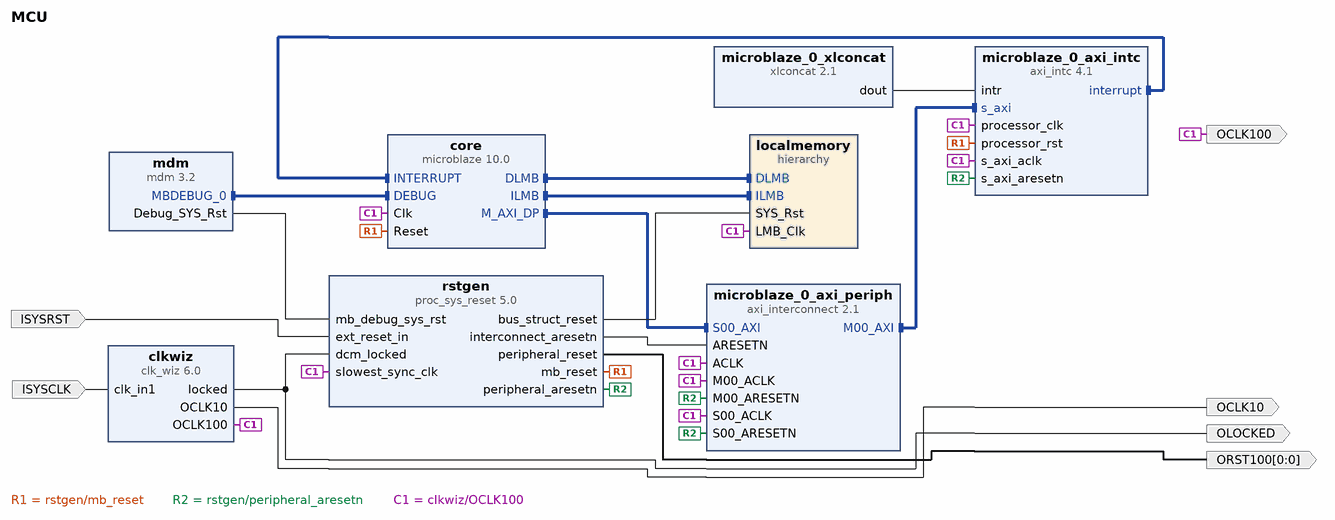
[diagram p0: block diagram of the top level]
# Vivado block design MCU, xc7a35ticsg324-1L, Vivado 2018.1
create_bd_design MCU

create_bd_port -dir I -type clk ISYSCLK
set_property -dict {CONFIG.FREQ_HZ 12000000} [get_bd_ports ISYSCLK]
create_bd_port -dir O -type clk OCLK100
create_bd_port -dir O -type clk OCLK10
set_property -dict {CONFIG.FREQ_HZ 10000000} [get_bd_ports OCLK10]
create_bd_port -dir I -type rst ISYSRST
set_property -dict {CONFIG.POLARITY ACTIVE_HIGH} [get_bd_ports ISYSRST]
create_bd_port -dir O OLOCKED
create_bd_port -dir O -from 0 -to 0 -type rst ORST100

create_bd_cell -type ip -vlnv xilinx.com:ip:microblaze:10.0 core
set_property -dict {CONFIG.C_D_AXI 1 CONFIG.C_D_LMB 1 CONFIG.C_I_LMB 1 CONFIG.C_DEBUG_ENABLED 1} [get_bd_cells core]
create_bd_cell -type hier localmemory
create_bd_cell -type ip -vlnv xilinx.com:ip:axi_interconnect:2.1 microblaze_0_axi_periph
set_property -dict {CONFIG.NUM_MI 1} [get_bd_cells microblaze_0_axi_periph]
create_bd_cell -type ip -vlnv xilinx.com:ip:axi_intc:4.1 microblaze_0_axi_intc
set_property -dict {CONFIG.C_HAS_FAST 1} [get_bd_cells microblaze_0_axi_intc]
create_bd_cell -type ip -vlnv xilinx.com:ip:xlconcat:2.1 microblaze_0_xlconcat
create_bd_cell -type ip -vlnv xilinx.com:ip:mdm:3.2 mdm
create_bd_cell -type ip -vlnv xilinx.com:ip:clk_wiz:6.0 clkwiz
set_property -dict [list \
  CONFIG.CLKOUT2_USED true \
  CONFIG.NUM_OUT_CLKS 2 \
  CONFIG.CLK_OUT1_PORT OCLK100 \
  CONFIG.CLK_OUT2_PORT OCLK10 \
  CONFIG.CLKOUT2_REQUESTED_OUT_FREQ 10.000 \
  CONFIG.PRIM_SOURCE Single_ended_clock_capable_pin \
  CONFIG.USE_RESET false \
  CONFIG.MMCM_DIVCLK_DIVIDE 1 \
  CONFIG.MMCM_CLKOUT1_DIVIDE 75 \
  CONFIG.CLKOUT2_JITTER 705.336 \
  CONFIG.CLKOUT2_PHASE_ERROR 668.310 \
] [get_bd_cells clkwiz]
create_bd_cell -type ip -vlnv xilinx.com:ip:proc_sys_reset:5.0 rstgen

# ---- hierarchy /localmemory ----
current_bd_instance /localmemory
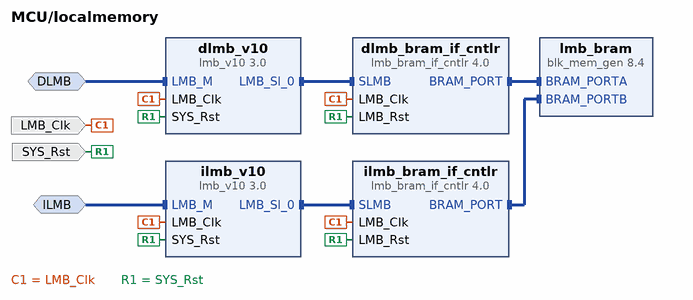
[diagram p1: block diagram inside /localmemory]
create_bd_intf_pin -mode MirroredMaster -vlnv xilinx.com:interface:lmb_rtl:1.0 DLMB
create_bd_intf_pin -mode MirroredMaster -vlnv xilinx.com:interface:lmb_rtl:1.0 ILMB
create_bd_pin -dir I -type clk LMB_Clk
create_bd_pin -dir I -type rst SYS_Rst

create_bd_cell -type ip -vlnv xilinx.com:ip:lmb_v10:3.0 dlmb_v10
create_bd_cell -type ip -vlnv xilinx.com:ip:lmb_v10:3.0 ilmb_v10
create_bd_cell -type ip -vlnv xilinx.com:ip:lmb_bram_if_cntlr:4.0 dlmb_bram_if_cntlr
set_property -dict {CONFIG.C_ECC 0} [get_bd_cells dlmb_bram_if_cntlr]
create_bd_cell -type ip -vlnv xilinx.com:ip:lmb_bram_if_cntlr:4.0 ilmb_bram_if_cntlr
set_property -dict {CONFIG.C_ECC 0} [get_bd_cells ilmb_bram_if_cntlr]
create_bd_cell -type ip -vlnv xilinx.com:ip:blk_mem_gen:8.4 lmb_bram
set_property -dict {CONFIG.Memory_Type True_Dual_Port_RAM CONFIG.use_bram_block BRAM_Controller} [get_bd_cells lmb_bram]

# ---- connections ----

current_bd_instance /localmemory
connect_bd_intf_net -intf_net microblaze_0_dlmb_bus [get_bd_intf_pins dlmb_v10/LMB_Sl_0] [get_bd_intf_pins dlmb_bram_if_cntlr/SLMB]
connect_bd_intf_net -intf_net microblaze_0_ilmb_bus [get_bd_intf_pins ilmb_v10/LMB_Sl_0] [get_bd_intf_pins ilmb_bram_if_cntlr/SLMB]
connect_bd_intf_net -intf_net microblaze_0_dlmb_cntlr [get_bd_intf_pins dlmb_bram_if_cntlr/BRAM_PORT] [get_bd_intf_pins lmb_bram/BRAM_PORTA]
connect_bd_intf_net -intf_net microblaze_0_ilmb_cntlr [get_bd_intf_pins ilmb_bram_if_cntlr/BRAM_PORT] [get_bd_intf_pins lmb_bram/BRAM_PORTB]
connect_bd_intf_net -intf_net microblaze_0_dlmb [get_bd_intf_pins DLMB] [get_bd_intf_pins dlmb_v10/LMB_M]
connect_bd_intf_net -intf_net microblaze_0_ilmb [get_bd_intf_pins ILMB] [get_bd_intf_pins ilmb_v10/LMB_M]
connect_bd_net -net microblaze_0_Clk [get_bd_pins LMB_Clk] \
  [get_bd_pins dlmb_v10/LMB_Clk] [get_bd_pins dlmb_bram_if_cntlr/LMB_Clk] [get_bd_pins ilmb_v10/LMB_Clk] \
  [get_bd_pins ilmb_bram_if_cntlr/LMB_Clk]
connect_bd_net [get_bd_pins SYS_Rst] \
  [get_bd_pins dlmb_v10/SYS_Rst] [get_bd_pins dlmb_bram_if_cntlr/LMB_Rst] [get_bd_pins ilmb_v10/SYS_Rst] \
  [get_bd_pins ilmb_bram_if_cntlr/LMB_Rst]

current_bd_instance /
connect_bd_intf_net -intf_net microblaze_0_dlmb_1 [get_bd_intf_pins core/DLMB] [get_bd_intf_pins localmemory/DLMB]
connect_bd_intf_net -intf_net microblaze_0_ilmb_1 [get_bd_intf_pins core/ILMB] [get_bd_intf_pins localmemory/ILMB]
connect_bd_intf_net -intf_net microblaze_0_axi_dp [get_bd_intf_pins microblaze_0_axi_periph/S00_AXI] [get_bd_intf_pins core/M_AXI_DP]
connect_bd_intf_net -intf_net microblaze_0_interrupt [get_bd_intf_pins microblaze_0_axi_intc/interrupt] [get_bd_intf_pins core/INTERRUPT]
connect_bd_intf_net -intf_net microblaze_0_intc_axi [get_bd_intf_pins microblaze_0_axi_periph/M00_AXI] [get_bd_intf_pins microblaze_0_axi_intc/s_axi]
connect_bd_intf_net -intf_net microblaze_0_debug [get_bd_intf_pins mdm/MBDEBUG_0] [get_bd_intf_pins core/DEBUG]
connect_bd_net -net microblaze_0_intr [get_bd_pins microblaze_0_xlconcat/dout] [get_bd_pins microblaze_0_axi_intc/intr]
connect_bd_net -net clk_wiz_1_locked [get_bd_pins clkwiz/locked] [get_bd_pins rstgen/dcm_locked] [get_bd_ports OLOCKED]
connect_bd_net -net rst_clk_wiz_1_100M_mb_reset [get_bd_pins rstgen/mb_reset] \
  [get_bd_pins core/Reset] [get_bd_pins microblaze_0_axi_intc/processor_rst]
connect_bd_net -net rst_clk_wiz_1_100M_bus_struct_reset [get_bd_pins rstgen/bus_struct_reset] [get_bd_pins localmemory/SYS_Rst]
connect_bd_net -net rst_clk_wiz_1_100M_interconnect_aresetn [get_bd_pins rstgen/interconnect_aresetn] [get_bd_pins microblaze_0_axi_periph/ARESETN]
connect_bd_net -net rst_clk_wiz_1_100M_peripheral_aresetn [get_bd_pins rstgen/peripheral_aresetn] \
  [get_bd_pins microblaze_0_axi_periph/S00_ARESETN] [get_bd_pins microblaze_0_axi_periph/M00_ARESETN] \
  [get_bd_pins microblaze_0_axi_intc/s_axi_aresetn]
connect_bd_net -net mdm_1_debug_sys_rst [get_bd_pins mdm/Debug_SYS_Rst] [get_bd_pins rstgen/mb_debug_sys_rst]
connect_bd_net -net clk_in1_0_1 [get_bd_ports ISYSCLK] [get_bd_pins clkwiz/clk_in1]
connect_bd_net [get_bd_pins clkwiz/OCLK100] \
  [get_bd_ports OCLK100] [get_bd_pins core/Clk] [get_bd_pins microblaze_0_axi_periph/ACLK] \
  [get_bd_pins microblaze_0_axi_periph/S00_ACLK] [get_bd_pins microblaze_0_axi_periph/M00_ACLK] \
  [get_bd_pins microblaze_0_axi_intc/s_axi_aclk] [get_bd_pins microblaze_0_axi_intc/processor_clk] \
  [get_bd_pins localmemory/LMB_Clk] [get_bd_pins rstgen/slowest_sync_clk]
connect_bd_net [get_bd_pins clkwiz/OCLK10] [get_bd_ports OCLK10]
connect_bd_net -net ext_reset_in_0_1 [get_bd_ports ISYSRST] [get_bd_pins rstgen/ext_reset_in]
connect_bd_net [get_bd_pins rstgen/peripheral_reset] [get_bd_ports ORST100]

# ---- address map ----
assign_bd_address -offset 0x00000000 -range 32K -target_address_space [get_bd_addr_spaces core/Data] [get_bd_addr_segs localmemory/dlmb_bram_if_cntlr/SLMB/Mem]
assign_bd_address -offset 0x41200000 -range 64K -target_address_space [get_bd_addr_spaces core/Data] [get_bd_addr_segs microblaze_0_axi_intc/S_AXI/Reg]
assign_bd_address -offset 0x00000000 -range 32K -target_address_space [get_bd_addr_spaces core/Instruction] [get_bd_addr_segs localmemory/ilmb_bram_if_cntlr/SLMB/Mem]

validate_bd_design
save_bd_design
